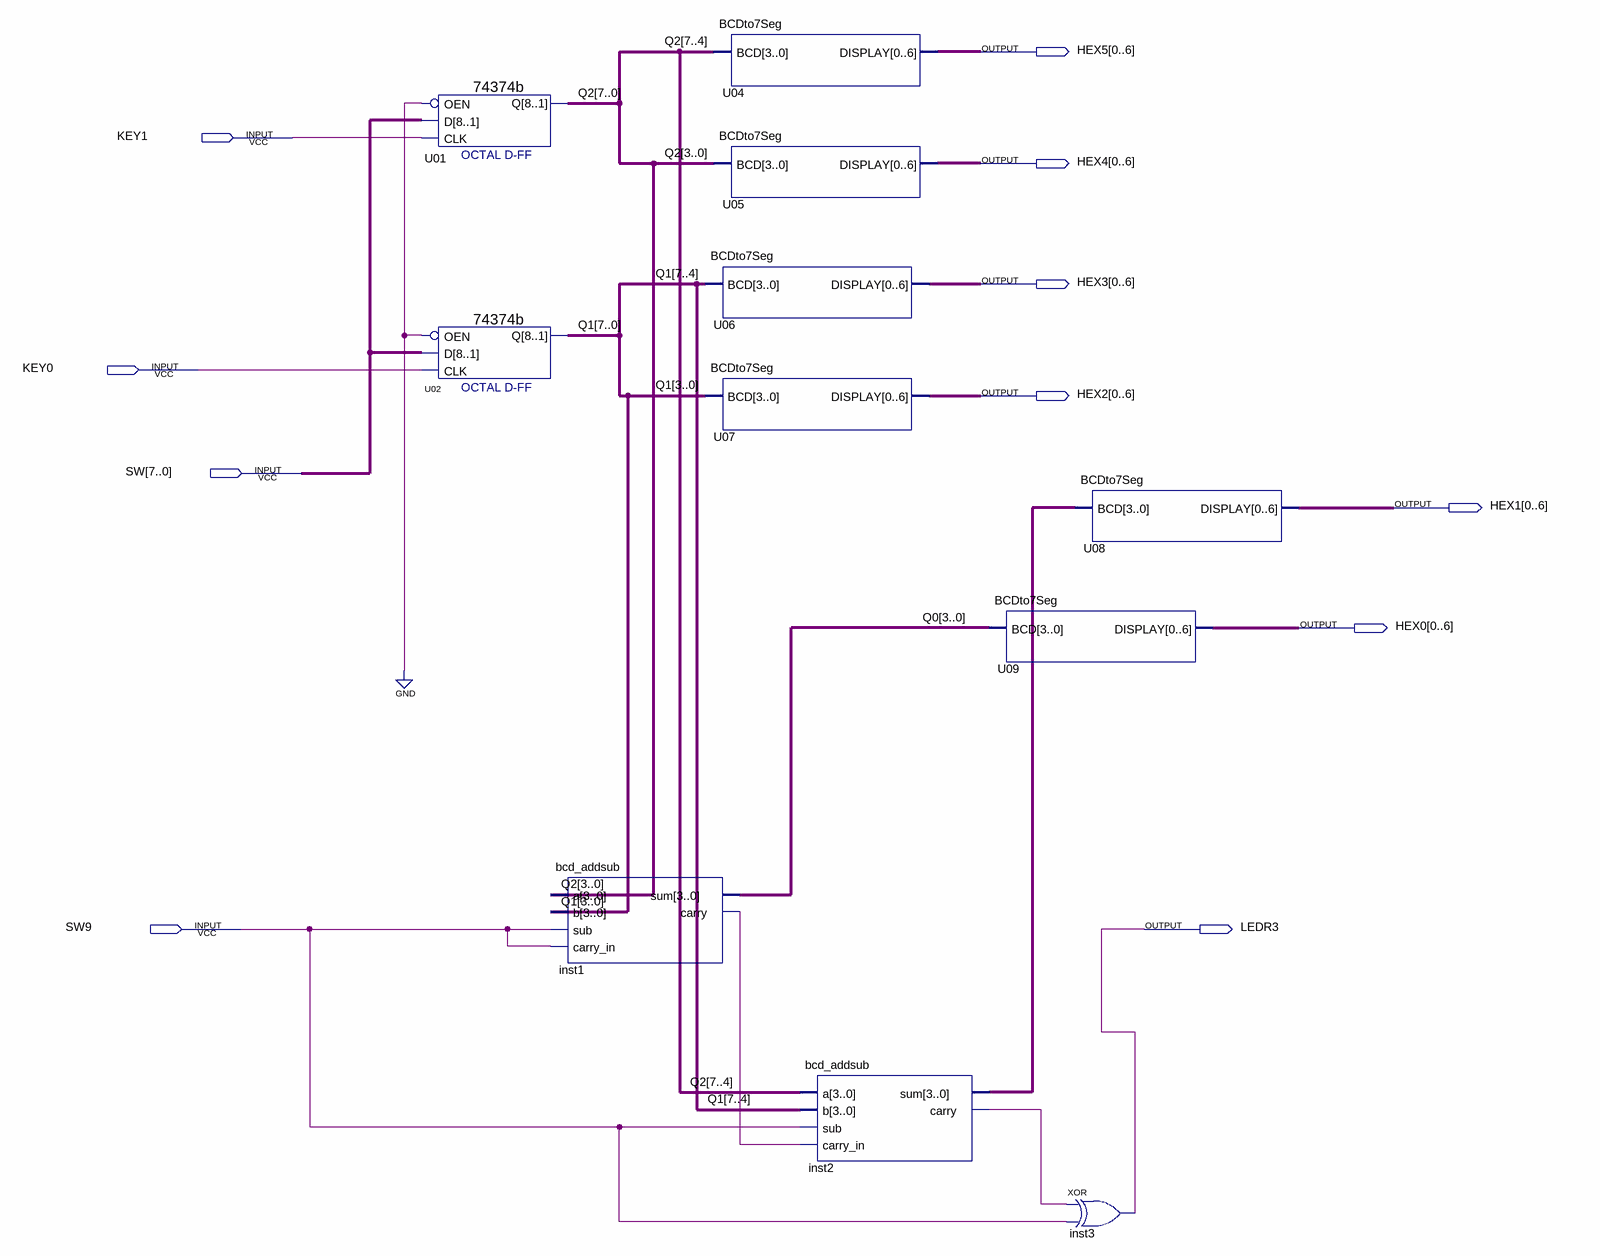
[diagram p0: schematic sheet]
// Quartus schematic LatchExample.bdf as structural Verilog: 11 symbols, 11 pins
module LatchExample (
  input  KEY1,
  input  KEY0,
  input  [7:0] SW,
  input  SW9,
  output [0:6] HEX5,
  output [0:6] HEX4,
  output [0:6] HEX3,
  output [0:6] HEX2,
  output [0:6] HEX1,
  output [0:6] HEX0,
  output LEDR3
);

  wire inst1_carry, inst2_carry;
  wire [3:0] inst2_sum, Q0;
  wire [7:0] Q1, Q2;

  \74374b  U01 (.D(SW), .OEN(1'b0), .CLK(KEY1), .Q(Q2));
  \74374b  U02 (.D(SW), .OEN(1'b0), .CLK(KEY0), .Q(Q1));
  bcd_addsub inst1 (.a(Q2[3:0]), .b(Q1[3:0]), .sub(SW9), .carry_in(SW9), .sum(Q0), .carry(inst1_carry));
  BCDto7Seg U04 (.BCD(Q2[7:4]), .DISPLAY(HEX5));
  BCDto7Seg U05 (.BCD(Q2[3:0]), .DISPLAY(HEX4));
  BCDto7Seg U06 (.BCD(Q1[7:4]), .DISPLAY(HEX3));
  BCDto7Seg U07 (.BCD(Q1[3:0]), .DISPLAY(HEX2));
  bcd_addsub inst2 (.a(Q2[7:4]), .b(Q1[7:4]), .sub(SW9), .carry_in(inst1_carry), .sum(inst2_sum), .carry(inst2_carry));
  BCDto7Seg U09 (.BCD(Q0), .DISPLAY(HEX0));
  BCDto7Seg U08 (.BCD(inst2_sum), .DISPLAY(HEX1));
  xor inst3 (LEDR3, inst2_carry, SW9);
endmodule
